# Altium schematic sheet RTU_LMG_LoRa_Module.SchDoc
size A3; SheetNumber: 11; SheetTotal: 15
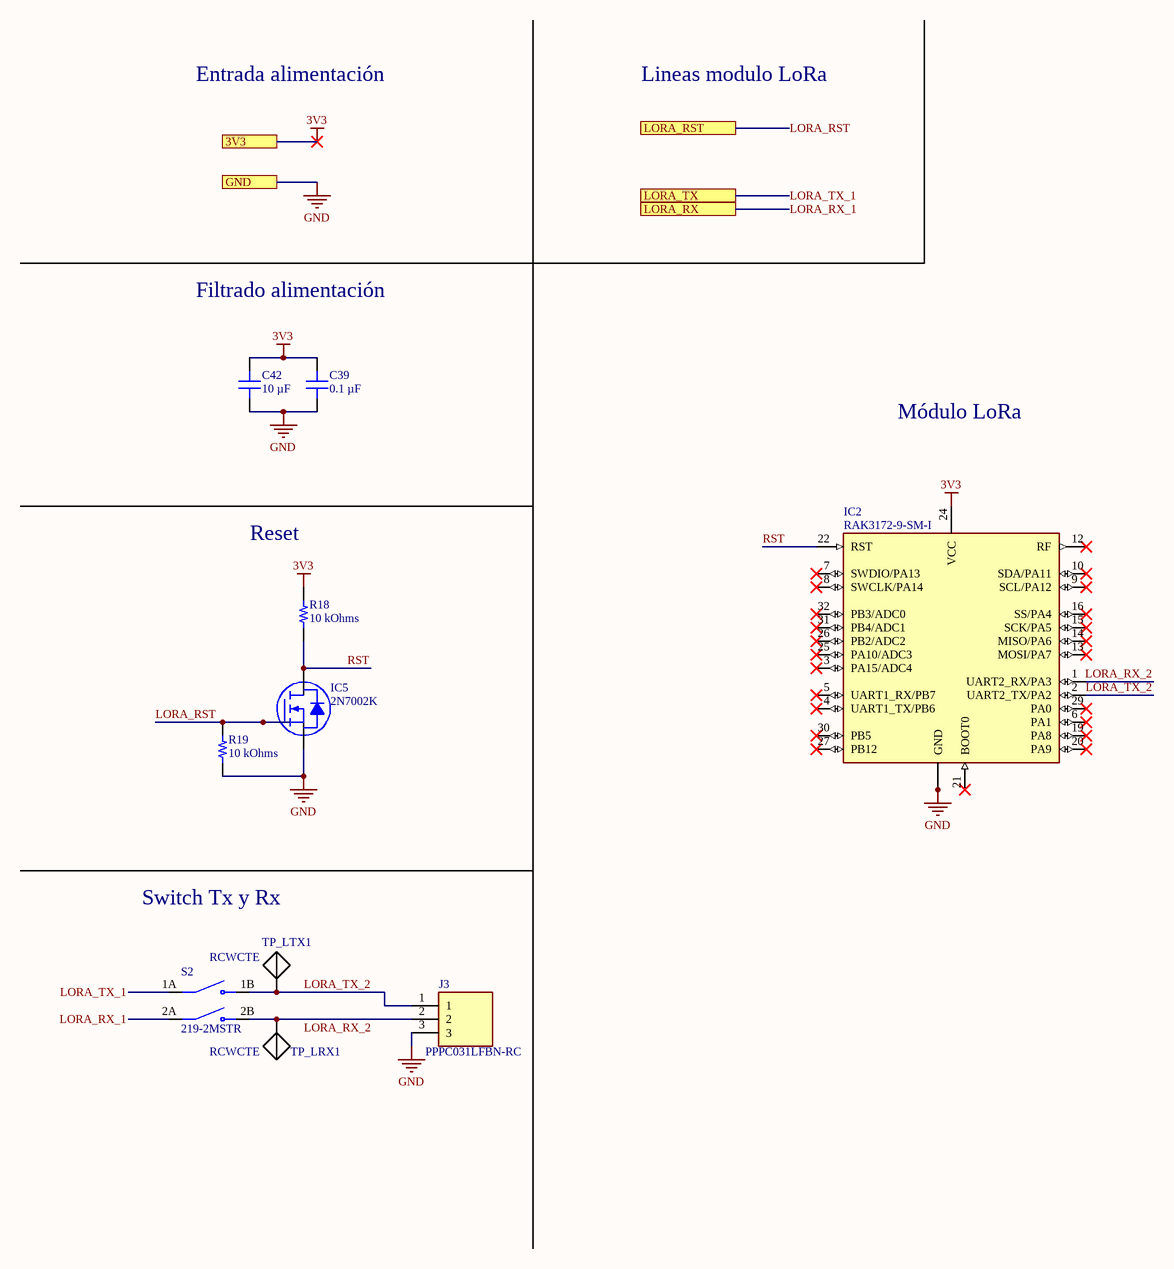
[diagram p0: RTU_LMG_LoRa_Module.SchDoc]

## Parts
C39  0.1 µF  [MURATA GRM155 0402_1005]
C42  10 µF  [CAP 0805_2012]
IC2  RAK3172-9-SM-I  [RAK3172-9-SM-I]
IC5  2N7002K  [ON SEMI SOT-23-3]
J3  PPPC031LFBN-RC  [PPPC031LFBN-RC]
R18  10 kOhms  [YAGEO RES 0603_1608]
R19  10 kOhms  [YAGEO RES 0603_1608]
S2  219-2MSTR  [SW_219-2MSTR]
TP_LRX1  RCWCTE  [RCWCTE]
TP_LTX1  RCWCTE  [RCWCTE]

## Ports
3V3, GND, LORA_RST, LORA_RX, LORA_TX

## Nets
3V3: C39.1 C42.2 IC2.24(VCC) R18.1 ; port 3V3
GND: C39.2 C42.1 IC2.11(GND) IC2.17(GND) IC2.18(GND) IC2.23(GND) IC2.28(GND) IC5.2(S) J3.3 R19.2 ; port GND
LORA_RST: IC5.1(G) R19.1 ; port LORA_RST
LORA_RX_1: S2.2A(COM2) ; port LORA_RX
LORA_RX_2: IC2.1(UART2_RX/PA3) J3.2 S2.2B(NO2) TP_LRX1.1(TP)
LORA_TX_1: S2.1A(COM1) ; port LORA_TX
LORA_TX_2: IC2.2(UART2_TX/PA2) J3.1 S2.1B(NO1) TP_LTX1.1(TP)
RST: IC2.22(RST) IC5.3(D) R18.2

Not connected (* = marked no-connect by the designer): IC2 3(PA15/ADC4)* 4(UART1_TX/PB6)* 5(UART1_RX/PB7)* 6(PA1)* 7(SWDIO/PA13)* 8(SWCLK/PA14)* 9(SCL/PA12)* 10(SDA/PA11)* 12(RF)* 13(MOSI/PA7)* 14(MISO/PA6)* 15(SCK/PA5)* 16(SS/PA4)* 19(PA8)* 20(PA9)* 21(BOOT0)* 25(PA10/ADC3)* 26(PB2/ADC2)* 27(PB12)* 29(PA0)* 30(PB5)* 31(PB4/ADC1)* 32(PB3/ADC0)*

## Notes on the sheet
- Entrada alimentación
- Lineas modulo LoRa
- Filtrado alimentación
- Módulo LoRa
- Reset
- Switch Tx y Rx

## Library data of the parts
C39 = GRM155R71H104KE14D: CAP CER 0.1UF 50V X7R 0402; manufacturer: Murata Electronics; Tolerance: ±10%; Part Number: GRM155R71H104KE14D; Value: 0.1 µF; Applications: General Purpose; Capacitance: 0.1 µF; componentlink1description: Datasheet; componentlink1url: https://search.murata.co.jp/Ceramy/image/img/A01X/G101/ENG/GRM155R71H104KE14-01.pdf; componentlink2description: DigiKey Link; componentlink2url: https://www.digikey.com/en/products/detail/murata-electronics/GRM155R71H104KE14D/4906220; Device Package: 0402 (1005 Metric); lastupdated: 8/27/2024 12:42:53 PM; Lifecycle Status: Active; Minimum Order: 1; Mounting Type: Surface Mount, MLCC; Operating Temperature: -55°C ~ 125°C; Package / Case: 0402 (1005 Metric); packaging: TapeAndReel; partid: 12677; Part Status: Active; price: 0.01; series: GRM; Size / Dimension: 0.039" L x 0.020" W (1.00mm x 0.50mm); Supplier 1: DigiKey; Supplier Part Number 1: 490-10700-1-ND; Temperature Coefficient: X7R; Thickness (Max): 0.022" (0.55mm); Voltage - Rated: 50V
C42 = CL21A106KOQNNNE: CAP CER 10UF 16V X5R 0805; manufacturer: Samsung Electro-Mechanics; Tolerance: ±10%; Part Number: CL21A106KOQNNNE; Value: 10 µF; Applications: General Purpose; Capacitance: 10 µF; componentlink1description: Datasheet; componentlink1url: http://www.samsungsem.com/kr/support/product-search/mlcc/CL21A106KOQNNNE.jsp; componentlink2description: DigiKey Link; componentlink2url: https://www.digikey.com/en/products/detail/samsung-electro-mechanics/CL21A106KOQNNNE/3886754; Device Package: 0805 (2012 Metric); lastupdated: 10/30/2023 7:13:57 PM; Lifecycle Status: Active; Minimum Order: 1; Mounting Type: Surface Mount, MLCC; Operating Temperature: -55°C ~ 85°C; Package / Case: 0805 (2012 Metric); packaging: TapeAndReel; partid: 14297; Part Status: Active; price: 0.01; series: CL; Size / Dimension: 0.079" L x 0.049" W (2.00mm x 1.25mm); Supplier 1: DigiKey; Supplier Part Number 1: 1276-1096-1-ND; Temperature Coefficient: X5R; Thickness (Max): 0.055" (1.40mm); Voltage - Rated: 16V
IC2 = RAK3172-9-SM-I: LoRaWAN module from RAK; MF: Shenzhen RAKwireless Technology Co.,Ltd.; Value: *; SnapEDA_Link: https://www.snapeda.com/parts/RAK3172/Shenzhen+RAKwireless+Technology+Co.%252CLtd./view-part/?ref=snap; Availability: Not in stock; Price: None; Package: Package; Check_prices: https://www.snapeda.com/parts/RAK3172/Shenzhen+RAKwireless+Technology+Co.%252CLtd./view-part/?ref=eda; MP: RAK3172-9-SM-I
IC5 = 2N7002K: MOSFET N-CH 60V 300MA SOT23; Manufacturer: ON Semiconductor; Current - Continuous Drain (Id) @ 25°C: 300mA (Ta); Drive Voltage (Max Rds On,  Min Rds On): 5V, 10V; FET Type: N-Channel; Input Capacitance (Ciss) (Max) @ Vds: 50pF @ 25V; Power Dissipation (Max): 350mW (Ta); Rds On (Max) @ Id, Vgs: 2Ohm @ 500mA, 10V; Vgs (Max): ±20V; Vgs(th) (Max) @ Id: 2.5V @ 250µA; Part Number: 2N7002K; ComponentLink1Description: Datasheet; ComponentLink1URL: https://www.onsemi.com/pub/Collateral/2N7002K-D.pdf; ComponentLink2Description: DigiKey Link; ComponentLink2URL: http://digikey.com/product-detail/en/on-semiconductor/2N7002K/2N7002KCT-ND/2060375; Drain to Source Voltage (Vdss): 60V; LastUpdated: 3/11/2024 8:04:14 AM; Lifecycle Status: Active; Minimum Order: 1; Mounting Type: Surface Mount; Operating Temperature: -55°C ~ 150°C (TJ); Package / Case: TO-236-3, SC-59, SOT-23-3; Packaging: TapeAndReel; Part Status: Active; Price: 0.07; Series: -; Supplier 1: DigiKey; Supplier Part Number 1: 2N7002KCT-ND; Supplier Device Package: SOT-23 (TO-236AB); Technology: MOSFET (Metal Oxide)
J3 = PPPC031LFBN-RC: Connector; Manufacturer_Name: Sullins; Datasheet Link: http://www.sullinscorp.com/drawings/78_P(N)PxCxxxLFBN-RC,_10492-H.pdf; Height: 8.5mm; Manufacturer_Part_Number: PPPC031LFBN-RC
R18 R19 = RC0603FR-0710KL: RES 10K OHM 1% 1/10W 0603; Manufacturer: Yageo; Power (Watts): 0.1W, 1/10W; Temperature Coefficient: ±100ppm/°C; Part Number: RC0603FR-0710KL; Value: 10 kOhms; ComponentLink1Description: Datasheet; ComponentLink1URL: https://www.yageo.com/upload/media/product/productsearch/datasheet/rchip/PYu-RC_Group_51_RoHS_L_10.pdf; ComponentLink2Description: DigiKey Link; ComponentLink2URL: https://www.digikey.com/en/products/detail/yageo/RC0603FR-0710KL/726880; Composition: Thick Film; Device Package: 0603 (1608 Metric); Features: Moisture Resistant; Height - Seated (Max): 0.022" (0.55mm); LastUpdated: 7/25/2024 9:19:19 AM; Lifecycle Status: Active; Minimum Order: 1; Number of Terminations: 2; Operating Temperature: -55°C ~ 155°C; Package / Case: 0603 (1608 Metric); Packaging: CutTape; PartId: 22599; Part Status: Active; Price: 0.01; Resistance: 10 kOhms; Series: RC_L; Size / Dimension: 0.063" L x 0.031" W (1.60mm x 0.80mm); Supplier 1: DigiKey; Supplier Part Number 1: 311-10.0KHRCT-ND; Supplier Device Package: 0603; Tolerance: ±1%
S2 = 219-2MSTR: Dip Switch SPST 2 Position Surface Mount Slide (Standard) Actuator 100mA 20VDC; MF: CTS Electrocomponents; SnapEDA_Link: https://www.snapeda.com/parts/219-2MSTR/CTS+Components/view-part/?ref=snap; Package: None; Value: *; MP: 219-2MSTR; Check_prices: https://www.snapeda.com/parts/219-2MSTR/CTS+Components/view-part/?ref=eda
TP_LRX1 TP_LTX1 = RCWCTE: - PC Test Point - - Plating Surface Mount Mounting Type; MF: KOA Speer; Check_prices: https://www.snapeda.com/parts/RCWCTE/KOA+Speer/view-part/?ref=eda; SnapEDA_Link: https://www.snapeda.com/parts/RCWCTE/KOA+Speer/view-part/?ref=snap; Digi-Key_Part_Number: 2019-RCWCTETR-ND; Value: *; Purchase-URL: https://pricing.snapeda.com/search/part/RCWCTE/?ref=eda; Package: None; MP: RCWCTE